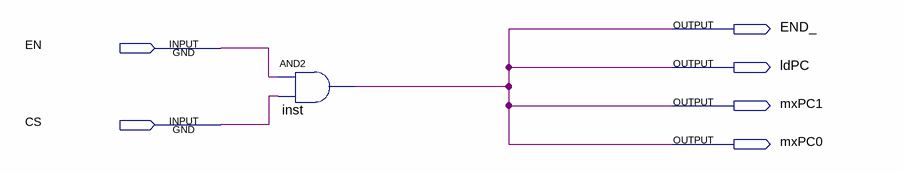
[diagram p0: schematic sheet]
// Quartus schematic BR.bdf as structural Verilog: 1 symbols, 6 pins
module BR (
  input  EN,
  input  CS,
  output END_,
  output ldPC,
  output mxPC1,
  output mxPC0
);

  and inst (END_, EN, CS);

  assign ldPC = END_;
  assign mxPC0 = END_;
  assign mxPC1 = END_;
endmodule
